# Altium project JacdacBrainESP32 48.PrjPCB (part 1 of 2)
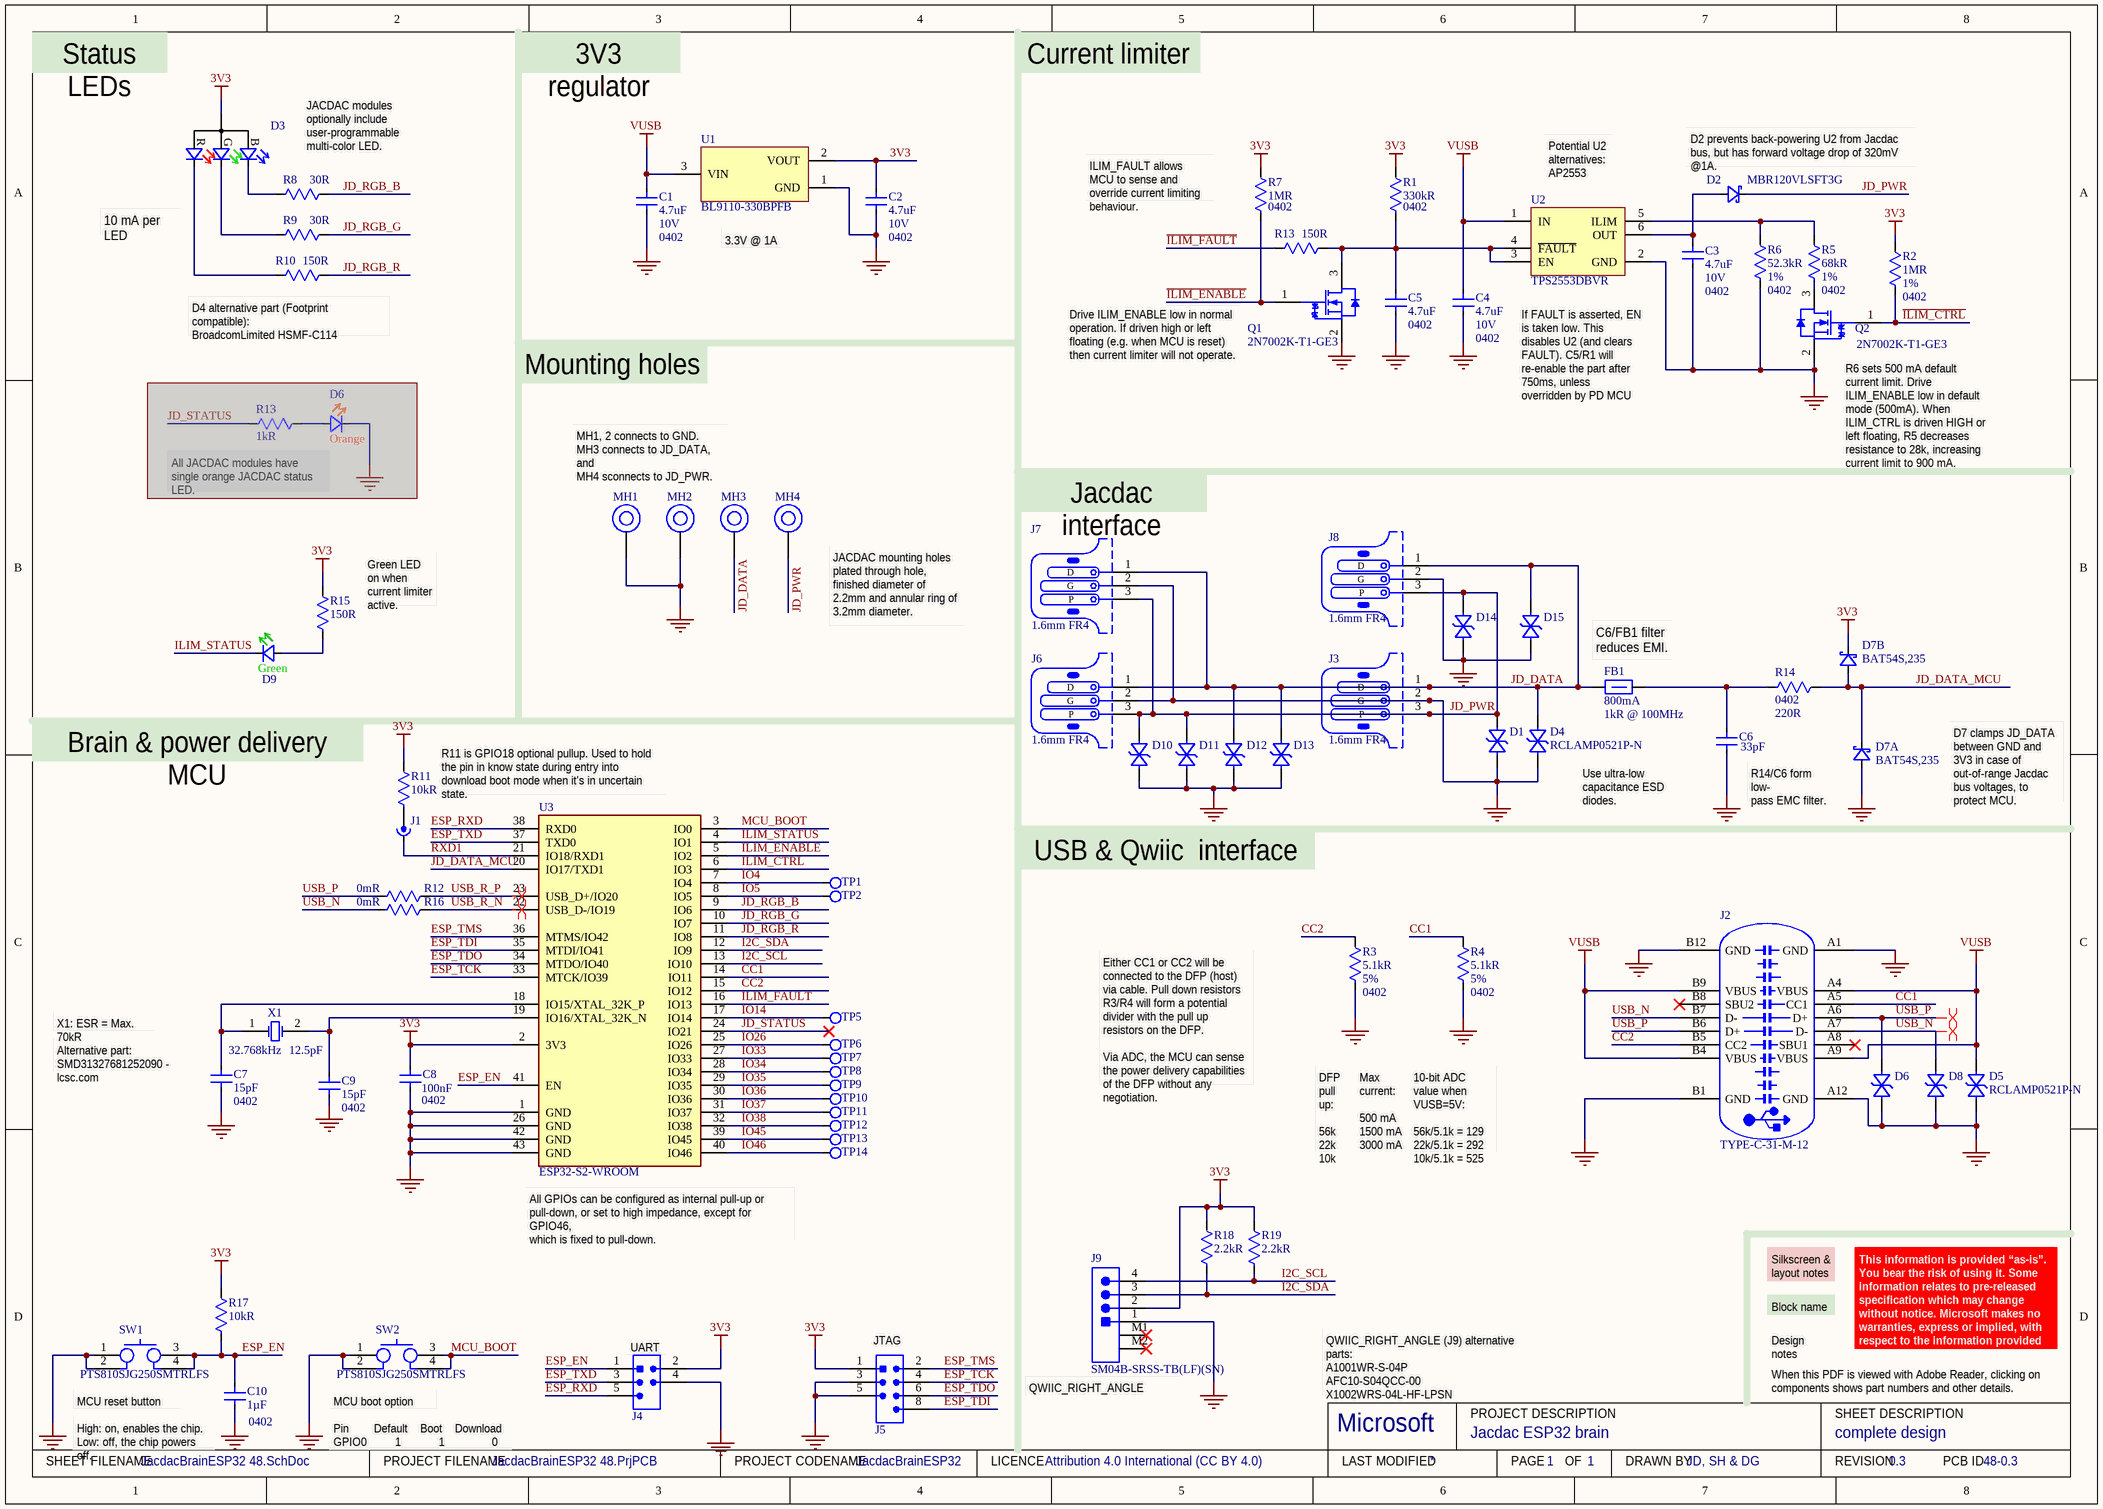
[diagram p0: JacdacBrainESP32 48.SchDoc]
ProjectCodeName: JacdacBrainESP32; ProjectCodenameDescription: Jacdac ESP32 brain; ProjectCodenameID: 48; ProjectDrawnBy: JD, SH & DG; ProjectLicenceTerms: Attribution 4.0 International (CC BY 4.0); ProjectRevision: 0.3
1 sheet, 80 parts. Net scope: global (net labels, ports and power ports of the same name join across sheets).
Board files: JacdacBrainESP32 48.PcbDoc, Panelized JacdacBrainESP32 48.PcbDoc

## Sheet JacdacBrainESP32 48.SchDoc: complete design
size A3; DrawnBy: JD, SH & DG; DocumentNumber: 1; Revision: 0.3; SheetNumber: 1; SheetTotal: 1; VersionControl_RevNumber: 1

### Parts
(Parts that share a designator on the sheet are numbered #1, #2 ... from top to bottom, then left to right.)
C1  Capacitance: 4.7uF  Voltage Rating: 10V  Case Code (Imperial): 0402  [R0402 - Without outline]  (hidden comment: CL05A475MP5NRNC)
C2  Capacitance: 4.7uF  Voltage Rating: 10V  Case Code (Imperial): 0402  [R0402 - Without outline]  (hidden comment: CL05A475MP5NRNC)
C3  Capacitance: 4.7uF  Voltage Rating: 10V  Case Code (Imperial): 0402  [R0402 - Without outline]  (hidden comment: CL05A475MP5NRNC)
C4  Capacitance: 4.7uF  Voltage Rating: 10V  Case Code (Imperial): 0402  [R0402 - Without outline]  (hidden comment: CL05A475MP5NRNC)
C5  Capacitance: 4.7uF  Case Code (Imperial): 0402  [R0402 - Without outline]  (hidden comment: CL05A475MP5NRNC)
C6  Capacitance: 33pF  [C0402_0.55MM - without outline]  (hidden comment: CL05C330JB5NNNC)
C7  Capacitance: 15pF  Case/Package: 0402  [C0402_0.55MM - without outline]  (hidden comment: CL05C150JB5NNNC)
C8  Capacitance: 100nF  Case Code (Imperial): 0402  [C0402_0.55MM - without outline]  (hidden comment: CL05B104KP5NNNC)
C9  Capacitance: 15pF  Case/Package: 0402  [C0402_0.55MM - without outline]  (hidden comment: CL05C150JB5NNNC)
C10  Capacitance: 1µF  Case Code (Imperial): 0402  [C0402_0.55MM - without outline]  (hidden comment: CL05A105KP5NNNC)
D1  RCLAMP0521P-N  [TVS 0402 - L]  (value not drawn)
D2  MBR120VLSFT3G  [MBR120VLSFT3G]
D3  TZ-P4-1615RGBTCA1-0.55T  [TZ-P4-1615RGBTCA1-0.55T]  (value not drawn)
D4  RCLAMP0521P-N  [TVS 0402 - L]
D5  RCLAMP0521P-N  [TVS 0402 - L]
D6#1  Colour: Orange  [Rohm SML-D12 Orange - without outline]  (hidden comment: SML-D12D)  (masked out: inside a compile mask, not in the netlist)
D6#2  RCLAMP0521P-N  [TVS 0402 - L]  (value not drawn)
D7  Manufacturer Part Number: BAT54S,235  [NXP-BAT54S-TO-236AB - without outline]  (hidden comment: BAT54S)  (parts A,B of 2)
D8  RCLAMP0521P-N  [TVS 0402 - L]  (value not drawn)
D9  Colour: Green  [0603 Green]  (hidden comment: 19-217/GHC-YR1S2/3T)
D10  RCLAMP0521P-N  [TVS 0402 - L]  (value not drawn)
D11  RCLAMP0521P-N  [TVS 0402 - L]  (value not drawn)
D12  RCLAMP0521P-N  [TVS 0402 - L]  (value not drawn)
D13  RCLAMP0521P-N  [TVS 0402 - L]  (value not drawn)
D14  RCLAMP0521P-N  [TVS 0402 - L]  (value not drawn)
D15  RCLAMP0521P-N  [TVS 0402 - L]  (value not drawn)
FB1  Current Rating: 800mA  Impedance: 1kR @ 100MHz  [TDK MPZ1608 0.8mm - without outline]  (hidden comment: TDK MPZ1608S102ATA00)
J1  OpenSolderBlob  [SolderBlobA]  (value not drawn)  (no BOM)
J2  TYPE-C-31-M-12  [TYPE-C-31-M-12]
J3  PCB Type: 1.6mm FR4  [JACDAC_EDGE_CONNECTOR_NO_TRACES]  (hidden comment: 3 pin jacdac edge connector)
J4  Uart Hack Connect Mini 1.27 mm pitch 2-row  [UART_HACK_CONNECT_MINI_5_X_1_27]  (value not drawn)
J5  7pin Jtag Hack Connect Mini 1.27 mm pitch 2-row  [JTAG_HACK_CONNECT_MINI_5_X_1_27]  (value not drawn)
J6  PCB Type: 1.6mm FR4  [JACDAC_EDGE_CONNECTOR_NO_TRACES]  (hidden comment: 3 pin jacdac edge connector)
J7  PCB Type: 1.6mm FR4  [JACDAC_EDGE_CONNECTOR_NO_TRACES]  (hidden comment: 3 pin jacdac edge connector)
J8  PCB Type: 1.6mm FR4  [JACDAC_EDGE_CONNECTOR_NO_TRACES]  (hidden comment: 3 pin jacdac edge connector)
J9  SM04B-SRSS-TB(LF)(SN)  [SM04B-SRSS-TB(LF)(SN)]
MH1  MH_5.0MMK_3.0MMC_2.1MMD_PTH  [MH_5.0MMK_3.0MMC_2.1MMD_PTH]  (value not drawn)  (no BOM)
MH2  MH_5.0MMK_3.0MMC_2.1MMD_PTH  [MH_5.0MMK_3.0MMC_2.1MMD_PTH]  (value not drawn)  (no BOM)
MH3  MH_5.0MMK_3.0MMC_2.1MMD_PTH  [MH_5.0MMK_3.0MMC_2.1MMD_PTH]  (value not drawn)  (no BOM)
MH4  MH_5.0MMK_3.0MMC_2.1MMD_PTH  [MH_5.0MMK_3.0MMC_2.1MMD_PTH]  (value not drawn)  (no BOM)
Q1  2N7002K-T1-GE3  [SOT-23-3 (TO-236)]
Q2  2N7002K-T1-GE3  [SOT-23-3 (TO-236)]
R1  Resistance: 330kR  Size Code: 0402  [R0402 - Without outline]  (hidden comment: RC0402FR-07330KL)
R2  Resistance: 1MR  Tolerance: 1%  Case Code (Imperial): 0402  [R0402 - Without outline]
R3  Resistance: 5.1kR  Tolerance: 5%  Case Code (Imperial): 0402  [R0402 - Without outline]  (hidden comment: RC0402JR-075K1L)
R4  Resistance: 5.1kR  Tolerance: 5%  Case Code (Imperial): 0402  [R0402 - Without outline]  (hidden comment: RC0402JR-075K1L)
R5  Resistance: 68kR  Tolerance: 1%  Case Code (Imperial): 0402  [R0402 - Without outline]  (hidden comment: RT0402FRE0768KL)
R6  Resistance: 52.3kR  Tolerance: 1%  Case Code (Imperial): 0402  [R0402 - Without outline]  (hidden comment: RC0402FR-0752K3L)
R7  Resistance: 1MR  Case Code (Imperial): 0402  [R0402 - Without outline]
R8  Resistance: 30R  [R0402 - Without outline]  (hidden comment: 0402WGF300JTCE)
R9  Resistance: 30R  [R0402 - Without outline]  (hidden comment: 0402WGF300JTCE)
R10  Resistance: 150R  [R0402 - Without outline]  (hidden comment: RC0402FR-07150RL)
R11  Resistance: 10kR  [R0402 - Without outline]  (hidden comment: 10k)
R12  Resistance: 0mR  [R0402 - Without outline]  (hidden comment: RC0402JR-070RL)
R13#1  Resistance: 150R  [R0402 - Without outline]  (hidden comment: RC0402FR-07150RL)
R13#2  Resistance: 1kR  [R0402 - Without outline]  (hidden comment: RC0402FR-071KL)  (masked out: inside a compile mask, not in the netlist)
R14  Case Code (Imperial): 0402  Resistance: 220R  [R0402 - Without outline]  (hidden comment: RC0402FR-07220RL)
R15  Resistance: 150R  [R0402 - Without outline]  (hidden comment: RC0402FR-07150RL)
R16  Resistance: 0mR  [R0402 - Without outline]  (hidden comment: RC0402JR-070RL)
R17  Resistance: 10kR  [R0402 - Without outline]  (hidden comment: 10k)
R18  Resistance: 2.2kR  [R0402 - Without outline]  (hidden comment: RC0402FR-072K2L)
R19  Resistance: 2.2kR  [R0402 - Without outline]  (hidden comment: RC0402FR-072K2L)
SW1  PTS810SJG250SMTRLFS  [PTS810]
SW2  PTS810SJG250SMTRLFS  [PTS810]
TP1  TestPoint  [Pad1.27mm]  (value not drawn)  (no BOM)
TP2  TestPoint  [Pad1.27mm]  (value not drawn)  (no BOM)
TP5  TestPoint  [Pad1.27mm]  (value not drawn)  (no BOM)
TP6  TestPoint  [Pad1.27mm]  (value not drawn)  (no BOM)
TP7  TestPoint  [Pad1.27mm]  (value not drawn)  (no BOM)
TP8  TestPoint  [Pad1.27mm]  (value not drawn)  (no BOM)
TP9  TestPoint  [Pad1.27mm]  (value not drawn)  (no BOM)
TP10  TestPoint  [Pad1.27mm]  (value not drawn)  (no BOM)
TP11  TestPoint  [Pad1.27mm]  (value not drawn)  (no BOM)
TP12  TestPoint  [Pad1.27mm]  (value not drawn)  (no BOM)
TP13  TestPoint  [Pad1.27mm]  (value not drawn)  (no BOM)
TP14  TestPoint  [Pad1.27mm]  (value not drawn)  (no BOM)
U1  BL9110-330BPFB  [SOT-223-]
U2  TPS2553DBVR  [TI-TPS2553]
U3  ESP32-S2-WROOM  [ESP32-S2-WROOM]
X1  Load Capacitance: 12.5pF  Frequency: 32.768kHz  [CRYSTAL-SMD-3.2X1.5]  (hidden comment: ECS-.327-12.5-34S-TR)

### Nets
3V3: C2.2 C8.2 D3.1(A) D7.2(K) J4.2(VCC) J5.1(VCC) J9.2(VCC) R1.1 R2.1 R7.1 R11.1 R15.2 R17.1 R18.1 R19.1 U1.2(VOUT) U3.2(3V3)
GND: C1.1 C2.1 C3.1 C4.1 C5.1 C6.1 C7.1 C8.1 C9.1 C10.1 D1.2(A) D4.2(A) D5.2(A) D6#2.2(A) D7.1(A) D8.2(A) D10.2(A) D11.2(A) D12.2(A) D13.2(A) D14.2(A) D15.2(A) J2.A1(GND) J2.A12(GND) J2.B1(GND) J2.B12(GND) J3.2(G) J4.4(GND) J5.3(GND) J5.5(RESET) J6.2(G) J7.2(G) J8.2(G) J9.1(GND) MH1.1 MH2.1 Q1.2(S) Q2.2(S) R3.2 R4.2 R6.1 SW1.1 SW1.2 SW2.1 SW2.2 U1.1(GND) U2.2(GND) U3.1(GND) U3.26(GND) U3.42(GND) U3.43(GND)
VUSB: C1.2 C4.2 D5.1(K) J2.A4(VBUS) J2.A9(VBUS) J2.B4(VBUS) J2.B9(VBUS) U1.3(VIN) U2.1(IN)
~{ILIM_CTRL}: Q2.1(G) R2.2 U3.6(IO3)
~{ILIM_ENABLE}: Q1.1(G) R7.2 U3.5(IO2)
~{ILIM_FAULT}: R13#1.1 U3.16(IO13)
CC1: J2.A5(CC1) R4.1 U3.14(IO11)
CC2: J2.B5(CC2) R3.1 U3.15(IO12)
ESP_EN: C10.2 J4.1(ESP_EN) R17.2 SW1.3 SW1.4 U3.41(EN)
ESP_RXD: J4.5(ESP_RXD) U3.38(RXD0)
ESP_TCK: J5.4(SWCLK/TCK) U3.33(MTCK/IO39)
ESP_TDI: J5.8(NC/TDI) U3.35(MTDI/IO41)
ESP_TDO: J5.6(SWO/TDO) U3.34(MTDO/IO40)
ESP_TMS: J5.2(SWDIO/TMS) U3.36(MTMS/IO42)
ESP_TXD: J4.3(ESP_TXD) U3.37(TXD0)
I2C_SCL: J9.4(SCL) R19.2 U3.13(IO10)
I2C_SDA: J9.3(SDA) R18.2 U3.12(IO9)
ILIM_STATUS: D9.1(K) U3.4(IO1)
IO4: TP1.1 U3.7(IO4)
IO5: TP2.1 U3.8(IO5)
IO14: TP5.1 U3.17(IO14)
IO26: TP6.1 U3.25(IO26)
IO33: TP7.1 U3.27(IO33)
IO34: TP8.1 U3.28(IO34)
IO35: TP9.1 U3.29(IO35)
IO36: TP10.1 U3.30(IO36)
IO37: TP11.1 U3.31(IO37)
IO38: TP12.1 U3.32(IO38)
IO45: TP13.1 U3.39(IO45)
IO46: TP14.1 U3.40(IO46)
JD_DATA: D4.1(K) D12.1(K) D13.1(K) D15.1(K) FB1.1 J3.1(D) J6.1(D) J7.1(D) J8.1(D) MH3.1
JD_DATA_MCU: D7.3(K) R14.1 U3.20(IO17/TXD1)
JD_PWR: D1.1(K) D2.1(K) D10.1(K) D11.1(K) D14.1(K) J3.3(P) J6.3(P) J7.3(P) J8.3(P) MH4.1
JD_RGB_B: R8.2 U3.9(IO6)
JD_RGB_G: R9.2 U3.10(IO7)
JD_RGB_R: R10.2 U3.11(IO8)
JD_STATUS: U3.24(IO21)
MCU_BOOT: SW2.3 SW2.4 U3.3(IO0)
RXD1: J1.2 U3.21(IO18/RXD1)
USB_N: D8.1(K) J2.A7(D-) J2.B7(D-) R16.1
USB_P: D6#2.1(K) J2.A6(D+) J2.B6(D+) R12.1
USB_R_N: R16.2 U3.22(USB_D-/IO19)
USB_R_P: R12.2 U3.23(USB_D+/IO20)
NetC3_2: C3.2 D2.2(A) U2.6(OUT)
NetC5_2: C5.2 Q1.3(D) R1.2 R13#1.2 U2.3(EN) U2.4(~{FAULT})
NetC6_2: C6.2 FB1.2 R14.2
NetC7_2: C7.2 U3.18(IO15/XTAL_32K_P) X1.1(OSC1/OSC2)
NetC9_2: C9.2 U3.19(IO16/XTAL_32K_N) X1.2(OSC2/OSC1)
NetD3_2: D3.2(R) R10.1
NetD3_3: D3.3(G) R9.1
NetD3_4: D3.4(B) R8.1
NetD9_2: D9.2(A) R15.1
NetJ1_1: J1.1 R11.2
NetQ2_3: Q2.3(D) R5.1
NetR5_2: R5.2 R6.2 U2.5(ILIM)

Not connected (* = marked no-connect by the designer): J2 A8(SBU1)* B8(SBU2)*; J9 M1* M2*

### Layout directives
differential pair: USB_N, USB_P, USB_R_N, USB_R_P

### Notes on the sheet
- Status LEDs
- 3V3 regulator
- Current limiter
- JACDAC modules optionally include user-programmable multi-color LED.
- (near U2) Potential U2 alternatives:
  AP2553
- (near D2) D2 prevents back-powering U2 from Jacdac bus, but has forward voltage drop of 320mV @1A.
- (near D3) 10 mA per LED
- (near U1) 3.3V @ 1A
- (near R7) ILIM_FAULT allows MCU to sense and override current limiting behaviour.
- (near R10) D4 alternative part (Footprint compatible):
  BroadcomLimited HSMF-C114
- Mounting holes
- Drive ILIM_ENABLE low in normal operation. If driven high or left floating (e.g. when MCU is reset) then current limiter will not operate.
- If FAULT is asserted, EN is taken low. This disables U2 (and clears FAULT). C5/R1 will re-enable the part after 750ms, unless overridden by PD MCU
- (near Q2) R6 sets 500 mA default current limit. Drive ILIM_ENABLE low in default mode (500mA). When ILIM_CTRL is driven HIGH or left floating, R5 decreases resistance to 28k, increasing current limit to 900 mA.
- All JACDAC modules have single orange JACDAC status LED.
- MH1, 2 connects to GND.
  MH3 connects to JD_DATA, and
  MH4 sconnects to JD_PWR.
- Jacdac interface
- (near R15) Green LED on when current limiter active.
- (near MH4) JACDAC mounting holes  plated through hole, finished diameter of 2.2mm and annular ring of 3.2mm diameter.
- (near FB1) C6/FB1 filter reduces EMI.
- (near R11) Brain & power delivery MCU
- R11 is GPIO18 optional pullup. Used to hold the pin in know state during entry into download boot mode when it's in uncertain state.
- Use ultra-low capacitance ESD diodes.
- R14/C6 form low-
  pass EMC filter.
- D7 clamps JD_DATA between GND and 3V3 in case of out-of-range Jacdac bus voltages, to protect MCU.
- USB & Qwiic  interface
- X1: ESR = Max. 70kR
- (near C7) Alternative part:
  SMD31327681252090 - lcsc.com
- Either CC1 or CC2 will be connected to the DFP (host) via cable. Pull down resistors R3/R4 will form a potential divider with the pull up resistors on the DFP.
  Via ADC, the MCU can sense the power delivery capabilities of the DFP without any negotiation.
- DFP pull up:
  56k
  22k
  10k
- Max current:
  500 mA
  1500 mA
  3000 mA
- 10-bit ADC value when VUSB=5V:
  56k/5.1k = 129
  22k/5.1k = 292
  10k/5.1k = 525
- All GPIOs can be configured as internal pull-up or pull-down, or set to high impedance, except for GPIO46,
  which is fixed to pull-down.
- Block name
- Silkscreen & layout notes
- (near J4) UART
- (near J5) JTAG
- (near J9) QWIIC_RIGHT_ANGLE
- QWIIC_RIGHT_ANGLE (J9) alternative parts:
  A1001WR-S-04P
  AFC10-S04QCC-00
  X1002WRS-04L-HF-LPSN
- Design notes
- When this PDF is viewed with Adobe Reader, clicking on components shows part numbers and other details.
- This information is provided “as-is”. You bear the risk of using it. Some information relates to pre-released specification which may change without notice. Microsoft makes no warranties, express or implied, with respect to the information provided here.
- (near SW1) MCU reset button
- (near C10) High: on, enables the chip.
  Low: off, the chip powers off.
- (near SW2) MCU boot option
- (near SW2) Pin        Default    Boot    Download
  GPIO0         1            1               0
- Microsoft
- PROJECT DESCRIPTION
- SHEET DESCRIPTION
- SHEET FILENAME
- PROJECT FILENAME
- PROJECT CODENAME
- LICENCE
- LAST MODIFIED
- PAGE
- OF
- DRAWN BY
- REVISION
- PCB ID

### Library data of the parts
C1-C5 = CL05A475MP5NRNC: CAP CER 4.7UF 10V X5R 0402; Manufacturer: Samsung; Tolerance: 20%; Supplier 1: Digi-Key; Manufacturer Part Number: CL05A475MP5NRNC; RoHS: Yes; Category: Ceramic Capacitors; Stock 1: 840000; Pricing 1: 10000=0.01405, 20000=0.01338 (USD); Mount: Surface Mount; Case/Package: 0402; Case Code (Metric): 1005; Min Operating Temperature: -55°C; Max Operating Temperature: 85°C; Package Quantity: 10000; Packaging: Tape and Reel; Dielectric: X5R; Series: CL; Length: 0.039inch; Width: 0.02inch; Thickness: 0.022inch; Lead Free: Lead Free; RoHS Compliant: Yes; ComponentLink1URL: https://datasheet.ciiva.com/25786/cl05a475mp5nrnc-25786963.pdf; ComponentLink1Description: Online datasheet; Supplier 2: Future Electronics; Stock 2: 2004; Pricing 2: 1=0.23500, 500=0.03970, 1500=0.02900, 2500=0.02500, 5000=0.02050 (USD); Created By: D. Gakure; Checked By: ?; Supplier Part Number 2: 2103694; Supplier Part Number 1: 1276-1482-2-ND
  C5: Voltage Rating: 10V
C6 = CL05C330JB5NNNC: Cap Ceramic 33pF 50V C0G 5% SMD 0402 125C Paper T/R; Manufacturer: Samsung; Temperature Coefficient: 300ppm/°C; Supplier 1: Digi-Key; Manufacturer Part Number: CL05C330JB5NNNC; RoHS: Yes; Category: Ceramic Capacitors; Stock 1: 5436288; Pricing 1: 1=0.10000, 10=0.02300, 50=0.01260, 100=0.01040, 500=0.00740, 1000=0.00582, 2500=0.00529, 5000=0.00487 (USD); Mount: Surface Mount; Case Code (Metric): 1005; Case Code (Imperial): 0402; Material: Ceramic; Contact Plating: Tin; Min Operating Temperature: -55°C; Max Operating Temperature: 125°C; Package Quantity: 1; Packaging: Tape and Reel; Dielectric: C0G; Voltage: 50V; Voltage Rating (DC): 50V; Series: CL; Construction: Flat; Length: 1mm; Width: 0.02inch; Height: 0.5mm; Thickness: 0.022inch; Depth: 0.5mm; Radiation Hardening: No; Lead Free: Lead Free; RoHS Compliant: Yes; Supplier 2: Farnell; Supplier 3: Mouser; Supplier Part Number 3: 187-CL05C330JB5NNNC; Supplier Part Number 2: 3013373; Supplier Part Number 1: 1276-1272-1-ND; Tolerance: 5%; Case/Package: 0402; Voltage Rating: 50V
C7 C9 = CL05C150JB5NNNC: CAP CER 15PF 50V C0G/NP0 0402; Manufacturer: Samsung; Material: Ceramic; Tolerance: 5%; Dielectric: C0G; Temperature Coefficient: 300ppm/°C; Supplier 1: Digi-Key; Manufacturer Part Number: CL05C150JB5NNNC; RoHS: Yes; Category: Ceramic Capacitors; Stock 1: 822355; Pricing 1: 1=0.10000, 10=0.02600, 50=0.01440, 100=0.01180, 500=0.00842, 1000=0.00661, 2500=0.00601, 5000=0.00553 (USD); Mount: Surface Mount; Case Code (Metric): 1005; Contact Plating: Tin; Min Operating Temperature: -55°C; Max Operating Temperature: 125°C; Package Quantity: 1; Packaging: Tape and Reel; Voltage Rating: 50V; Voltage: 50V; Series: CL; Construction: Flat; Length: 1mm; Width: 0.02inch; Height: 0.5mm; Thickness: 0.022inch; Depth: 0.5mm; Radiation Hardening: No; RoHS Compliant: Yes; ComponentLink1URL: https://datasheet.ciiva.com/15195/getdatasheetpartid-497170-15195669.pdf; ComponentLink1Description: Online datasheet; Supplier 2: Mouser; Stock 2: 313617; Pricing 2: 1=0.10000, 10=0.01400, 50=0.01400, 100=0.01200, 1000=0.00700, 10000=0.00500 (USD); Supplier Part Number 2: 187-CL05C150JB5NNNC; Supplier Part Number 1: 1276-1179-1-ND; Case Code (Imperial): 0402
C8 = CL05B104KP5NNNC: CAP CER 0.1UF 10V X7R 0402; Manufacturer: Samsung; Tolerance: 10%; Supplier 1: Digi-Key; Manufacturer Part Number: CL05B104KP5NNNC; RoHS: Yes; Category: Ceramic Capacitors; Stock 1: 17321183; Pricing 1: 1=0.10000, 10=0.02500, 50=0.01380, 100=0.01130, 500=0.00804, 1000=0.00632, 2500=0.00575, 5000=0.00529 (USD); Mount: Surface Mount; Case/Package: 0402; Case Code (Metric): 1005; Contact Plating: Tin; Min Operating Temperature: -55°C; Max Operating Temperature: 125°C; Package Quantity: 1; Packaging: Tape and Reel; Dielectric: X7R; Length: 1mm; Width: 0.02inch; Height: 0.5mm; Thickness: 0.022inch; Depth: 0.5mm; Radiation Hardening: No; ComponentLink1URL: https://datasheet.ciiva.com/15165/getdatasheetpartid-37100-15165107.pdf; ComponentLink1Description: Samsung datasheet online; Supplier 2: Mouser; Stock 2: 984124; Pricing 2: 10000=0.00400, 20000=0.00400, 50000=0.00400 (USD); Supplier 3: Farnell; Stock 3: 39022; Pricing 3: 10=0.01620, 100=0.01310, 500=0.00740, 2500=0.00600, 5000=0.00470, 10000=0.00400, 50000=0.00320 (GBP); Supplier 4: Newark; Stock 4: 56730; Pricing 4: 1=0.09000, 25=0.02300, 100=0.01000, 250=0.00900, 500=0.00700, 1000=0.00500, 2500=0.00500 (USD); Supplier 5: Future Electronics; Stock 5: 20877033; Pricing 5: 1=0.00460, 500=0.00340, 1500=0.00320, 2500=0.00310, 5000=0.00300 (USD); Supplier Part Number 5: 9032525; Supplier Part Number 4: 82AC9219; Supplier Part Number 2: 187-CL05B104KP5NNNC; Supplier Part Number 1: 1276-1002-1-ND; Created: DG; Checked: ?; Supplier Part Number 3: 3013351; Voltage Rating: 10V
C10 = CL05A105KP5NNNC: CAP CER 1UF 10V X5R 0402; Manufacturer: Samsung; Material: Ceramic; Tolerance: 10%; Supplier 1: Digi-Key; Manufacturer Part Number: CL05A105KP5NNNC; RoHS: Yes; Category: Capacitors; Stock 1: 5705569; Pricing 1: 1=0.10000, 10=0.03900, 50=0.02100, 100=0.01720, 500=0.01228, 1000=0.00965, 2500=0.00877, 5000=0.00807 (USD); Mount: Surface Mount; Case/Package: 0402; Case Code (Metric): 1005; Contact Plating: Tin; Min Operating Temperature: -55°C; Max Operating Temperature: 85°C; Dielectric: X5R; Package Quantity: 1; Packaging: Tape and Reel; Length: 1mm; Height: 0.5mm; Width: 0.02inch; Thickness: 0.022inch; Depth: 0.5mm; Radiation Hardening: No; ComponentLink1URL: https://datasheet.ciiva.com/15195/getdatasheetpartid-358390-15195630.pdf; ComponentLink1Description: Online datasheet; Supplier 2: Mouser; Stock 2: 928941; Pricing 2: 1=0.10000, 10=0.04200, 100=0.01800, 500=0.01300, 1000=0.01000, 2500=0.00900 (USD); Supplier 3: Farnell; Stock 3: 53670; Pricing 3: 10=0.02450, 100=0.02000, 500=0.01310, 2500=0.00920, 5000=0.00810, 10000=0.00640, 50000=0.00490 (GBP); Supplier Part Number 3: 3013329; Supplier Part Number 2: 187-CL05A105KP5NNNC; Supplier Part Number 1: 1276-1076-1-ND; Created: DG; Checked: ?; Voltage Rating: 10V
D1 D4 D5 D6#2 D8 D10-D15 = RCLAMP0521P-N: Bidirectional 5V (Max) 6V 16V 3.5A (8/20us) 0402 TVS RoHS; Manufacturer: Born Semiconductor; Package: 0402; Created By: D Gakure; Checked By: ?; Supplier1: LCSC; Supplier1 Part Number: C316043; ComponentLink1Description: Online datasheet; ComponentLink1URL: https://datasheet.lcsc.com/szlcsc/Bourne-Semicon-Shenzhen-RCLAMP0521P-N_C316043.pdf; Manufacturer Part Number: RCLAMP0521P-N
D2 = MBR120VLSFT3G: DIODE SCHOTTKY 20V 1A SOD123FL; Manufacturer: ON Semiconductor; Max Surge Current: 45A; Forward Voltage: 340mV; Peak Reverse Current: 600uA; Element Configuration: Single; Polarity: Standard; Supplier 1: Digi-Key; RoHS: Yes; Category: Schottky Diodes; Stock 1: 32481; Pricing 1: 1=0.39000, 10=0.28600, 100=0.19920, 500=0.12616, 1000=0.10292, 2000=0.09960, 5000=0.09628 (USD); Number of Pins: 2; Min Operating Temperature: -65°C; Max Operating Temperature: 125°C; Package Quantity: 10000; Forward Current: 1A; Packaging: Tape and Reel; Max Reverse Leakage Current: 600uA; Average Rectified Current: 1A; Peak Non-Repetitive Surge Current: 45A; Max Repetitive Reverse Voltage (Vrrm): 20V; Max Forward Surge Current (Ifsm): 45A; Voltage Rating (DC): 20V; Current Rating: 1A; Output Current: 1A; Max Reverse Voltage (DC): 20V; Radiation Hardening: No; REACH SVHC: No SVHC; Lead Free: Lead Free; Halogen Free: Halogen Free; ComponentLink4URL: https://datasheet.ciiva.com/6380/mbr120vlsft1-d-6380910.pdf; ComponentLink4Description: On Semi datasheet online; Supplier 2: Mouser; Supplier 3: RSComponents; Supplier Part Number 3: 1867479; Supplier Part Number 2: 863-MBR120VLSFT3G; Supplier Part Number 1: MBR120VLSFT3GOSCT-ND; Manufacturer Part Number: MBR120VLSFT3G
D3 = TZ-P4-1615RGBTCA1-0.55T: 1615 Light Emitting Diodes (LED) RoHS; Manufacturer: TUOZHAN; Manufacturer Part Number: TZ-P4-1615RGBTCA1-0.55T; Category: Optoelectronics; Package: 1615; ComponentLink1Description: Online datasheet; ComponentLink1URL: https://datasheet.lcsc.com/szlcsc/2009041238_TUOZHAN-TZ-P4-1615RGBTCA1-0-55T_C779813.pdf; RoHS: RoHS Compliant; Supplier 1: LCSC; Size / Dimension: 1.6x1.5mm; Supplier 1 Part Number: C779813; Packaging: Tape & Reel (TR); Created By: D. Gakure; Checked By: ?
D6#1 = SML-D12D: 1.6 x 0.8 x 0.55mm (0603) LED 605nm Orange; Manufacturer: Rohm Semiconductor; Manufacturer Part Number: SML-D12D8WT86; Millicandela Rating: 100mcd; Voltage - Forward (Vf) (Typ): 2.2V; Current - Test: 20mA; Lens Type: Diffused, White; Lens Style/Size: Rectangle with Flat Top, 1.2mm x 0.8mm; Supplier 1: Digi-Key; RoHS: RoHS Compliant; Category: Optoelectronics; Stock 1: 1719; Pricing 1: 1=0.38, 10=0.279, 25=0.2232, 100=0.1478, 250=0.1046, 500=0.08926, 1000=0.06974 (GBP); Packaging: Cut Tape (CT); Wavelength - Dominant: 605nm; Wavelength - Peak: -; Viewing Angle: -; Package / Case: 0603 (1608 Metric); Size / Dimension: 1.60mm L x 0.80mm W; Height: 0.55mm; Mounting Type: Surface Mount; Luminous Flux @ Current - Test: -; ComponentLink1URL: https://d1d2qsbl8m0m72.cloudfront.net/en/products/databook/datasheet/opto/led/chip_mono/sml-d12x8_d13x8-e.pdf; ComponentLink1Description: Online datasheet; Supplier Part Number 1: 511-1577-1-ND
D7 = BAT54S: DIODE ARRAY SCHOTTKY 30V SOT23; Manufacturer: Nexperia; Supplier 1: Digi-Key; RoHS: No; Category: Rectifier Diodes; Stock 1: 14011; Pricing 1: 1=0.13000, 10=0.11900, 100=0.05610, 500=0.03326, 1000=0.02185, 5000=0.02138 (USD); ComponentLink1URL: https://assets.nexperia.com/documents/data-sheet/BAT54_SER.pdf; ComponentLink1Description: NXP datasheet online; Supplier 2: Mouser; Supplier 3: RSComponents; Supplier Part Number 2: 771-BAT54S235; Supplier Part Number 3: 1707990; Supplier Part Number 1: 1727-1868-1-ND
D9 = 19-217/GHC-YR1S2/3T: LED GREEN DIFFUSED 0603 SMD; Manufacturer: Everlight Elec; Manufacturer Part Number: 19-217/GHC-YR1S2/3T; Mount: Surface Mount; Case/Package: 0603; Color: Green; Case Code (Imperial): 0603; ComponentLink1URL: https://datasheet.lcsc.com/lcsc/1811101510_Everlight-Elec-19-217-GHC-YR1S2-3T_C72043.pdf; ComponentLink1Description: Online datasheet; Supplier 1: LCSC; Supplier 1 Part Number: C72043
FB1 = TDK MPZ1608S102ATA00: 0603 1k@100MHz 0.8A chip; Core Material: Ferrite; Tolerance: 25%; DC Resistance (DCR): 300mR; Supplier 1: Digi-Key; Stock 1: 113542; Pricing 1: 1=0.1, 10=0.079, 25=0.0716, 50=0.0644, 100=0.0472, 250=0.03432, 500=0.03146, 1000=0.02717 (USD); Mount: Surface Mount; Case/Package: 0603; Case Code (Metric): 1608; Case Code (Imperial): 0603; Package Quantity: 4000; Packaging: Tape and Reel; Max DC Current: 800mA; Length: 0.063inch; Height: 0.037inch; Width: 0.031inch; ComponentLink2URL: https://www.mouser.co.uk/datasheet/2/400/eads_commercial_power_mpz1608_en-923650.pdf; ComponentLink2Description: datasheet online; Supplier 2: Mouser; ComponentLink3Description: datasheet; ComponentLink3URL: Y:\System\Altium\Libraries 2014\TDK\Datasheets\eads_commercial_power_mpz1608_en-923650.pdf; Supplier Part Number 1: 445-8694-1-ND; Supplier Part Number 2: 810-MPZ1608S102ATA00; Manufacturer: TDK; Manufacturer Part Number: MPZ1608S102ATA00
J1 = OpenSolderBlob: Open solder blob
J2 = TYPE-C-31-M-12: USB - Type C Female 16 USB Connectors RoHS; Manufacturer: Korean Hroparts Elec; Gender: Receptacle; Number of Positions: 16; RoHS: Yes; Category: USB Connectors; Orientation: Right Angle; ComponentLink1URL: https://datasheet.lcsc.com/szlcsc/1811131825_Korean-Hroparts-Elec-TYPE-C-31-M-12_C165948.pdf; ComponentLink1Description: Online datasheet; Supplier 1 Part Number: C165948; Supplier 1: LCSC; Manufacturer Part Number: TYPE-C-31-M-12
J3 J6-J8 = Jacdac edge connector: 3 pin Jacdac edge connector 1.27mm pitch; Manufacturer Part Number: JACDAC_EDGE_CONNECTOR; Checked By: ?; Created By: D. Gakure; ComponentLink1Description: Yuliang JACDAC cable connector drawing online; ComponentLink1URL: https://github.com/microsoft/jacdac-mdk/blob/main/connector/JACDAC-Connector-by-Yuliang-2020-11-28.pdf; ComponentLink2Description: JACDAC PCB edge connector spec onlin; ComponentLink2URL: https://github.com/microsoft/jacdac-mdk/blob/main/connector/JACDAC_PCB_Edge_Connector_Drawing_JD-PEC-01_rev_01.pdf
J4 = UART_HACK_CONNECT_MINI
J5 = JTAG_HACK_CONNECT
J9 = SM04B-SRSS-TB(LF)(SN): CONN HEADER SMD R/A 4POS 1MM; Manufacturer: JST; Number of Positions: 4; Connector Type: Male Pin; Contact Resistance: 40mR; Max Current Rating: 1A; Max Voltage Rating (AC): 50V; Pitch: 0.039inch; Supplier 1: Digi-Key; RoHS: Yes; Category: Connectors; Pricing 1: 1=0.55000, 10=0.51700, 100=0.39640, 500=0.34468, 1000=0.28436 (USD); Mount: Surface Mount; Contact Material: Copper Alloy; Contact Plating: Tin,Copper; Color: Natural; Housing Material: Polyamide; Housing Color: Beige; Min Operating Temperature: -25°C; Max Operating Temperature: 85°C; Number of Rows: 1; Termination: Solder; Packaging: Tape and Reel; Orientation: Right Angle; Number of Contacts: 4; Max Voltage Rating (DC): 50V; Length: 6mm; Depth: 4.95mm; Lead Free: Lead Free; ComponentLink1URL: https://datasheet.ciiva.com/26894/getdatasheetpartid-499363-26894945.pdf?src-supplier=Verical; ComponentLink1Description: Online datasheet; Supplier 2: Farnell; Stock 2: 8030; Pricing 2: 10=0.42800, 100=0.32800, 500=0.28500, 1000=0.23600, 2500=0.23100 (GBP); Supplier 3: Future Electronics; Stock 3: 9000; Pricing 3: 3000=0.36000, 6000=0.29000 (USD); Supplier 4: Newark; Stock 4: 10006; Pricing 4: 1=0.67900, 10=0.63700, 25=0.54900, 50=0.49500, 100=0.46200, 250=0.41000, 500=0.39800, 1000=0.36200 (USD); Supplier Part Number 4: 87R0314; Supplier Part Number 3: 4517173; Supplier Part Number 2: 1830839; Supplier Part Number 1: 455-1804-1-ND; Manufacturer Part Number: SM04B-SRSS-TB(LF)(SN)
MH1-MH4 = MH_5.0MMK_3.0MMC_2.1MMD_PTH: Mounting Hole 5.0mm keepout, 3.0mm annualar ring and 2.1mm Drill PTH
Q1 Q2 = 2N7002K-T1-GE3: Trans MOSFET N-CH Si 60V 0.3A 3-Pin SOT-23 T/R; Manufacturer: Vishay; Rds On Max: 2R; Input Capacitance: 30pF; Max Power Dissipation: 350mW; Continuous Drain Current (ID): 300mA; Element Configuration: Single; Nominal Vgs: 2V; Number of Elements: 1; Gate to Source Voltage (Vgs): 20V; Turn-Off Delay Time: 35ns; Threshold Voltage: 1V; Turn-On Delay Time: 25ns; Supplier 1: Digi-Key; RoHS: Yes; Category: MOSFETs; Pricing 1: 1=0.27000, 10=0.21800, 25=0.18200, 100=0.11540, 500=0.07590, 1000=0.05161 (USD); Mount: Surface Mount; Case/Package: SOT-23; Number of Pins: 3; Contact Plating: Tin,Matte; Weight: 0.050717oz; Min Operating Temperature: -55°C; Max Operating Temperature: 150°C; Packaging: Tape and Reel; Drain to Source Voltage (Vdss): 60V; On-State Resistance: 2R; Voltage: 60V; Package Quantity: 1; Number of Channels: 1; Drain to Source Breakdown Voltage: 60V; Drain to Source Resistance: 2R; Power Dissipation: 350mW; Length: 3.04mm; Width: 1.4mm; Height: 1.02mm; Radiation Hardening: No; Lead Free: Lead Free; REACH SVHC: Unknown; ComponentLink1URL: https://datasheet.ciiva.com/2957/2n7002k-2957216.pdf; ComponentLink1Description: Online datasheet; Supplier 2: RSComponents; Stock 2: 1; Pricing 2: 100=0.11100 (USD); Supplier Part Number 1: 2N7002K-T1-GE3CT-ND; Supplier Part Number 2: 7879058P; Manufacturer Part Number: 2N7002K-T1-GE3
R1 = RC0402FR-07330KL: RES SMD 330K OHM 1% 1/16W 0402; Manufacturer: Yageo; Power Rating: 63mW; Voltage Rating: 50V; Temperature Coefficient: 100ppm/°C; Supplier 1: Digi-Key; Manufacturer Part Number: RC0402FR-07330KL; RoHS: Yes; Category: Chip SMD Resistors; Stock 1: 78809; Pricing 1: 1=0.10000, 10=0.01600, 100=0.00660, 1000=0.00299, 2500=0.00259, 5000=0.00214 (USD); Case/Package: 0402; Case Code (Metric): 1005; Case Code (Imperial): 0402; Min Operating Temperature: -55°C; Max Operating Temperature: 155°C; Package Quantity: 1; Packaging: Tape and Reel; Resistor Type: Thick Film; Number of Terminations: 2; Termination: SMD/SMT; Max Power Dissipation: 63mW; Features: Moisture Resistant; Series: RC; Resistance Tolerance: 1%; Construction: Rectangular; Length: 1mm; Width: 0.02inch; Height: 0.016inch; Depth: 0.5mm; REACH SVHC: Unknown; Military Standard: Not; Lead Free: Lead Free; RoHS Compliant: Yes; ComponentLink1URL: https://datasheet.ciiva.com/2518/pyu-r-int-thick-7-2518994.pdf?src-supplier=Digi-Key; ComponentLink1Description: Online datasheet; Supplier 2: Mouser; Stock 2: 218637; Pricing 2: 1=0.10000, 10=0.01400, 50=0.01400, 100=0.00500, 1000=0.00300, 10000=0.00200 (USD); Supplier 3: Farnell; Stock 3: 310234; Pricing 3: 10=0.01210, 100=0.00460, 500=0.00410, 2500=0.00310, 5000=0.00280, 10000=0.00250, 50000=0.00180 (GBP); Supplier Part Number 2: 603-RC0402FR-07330KL; Supplier Part Number 1: 311-330KLRCT-ND; Supplier Part Number 3: 9239537; Created By: D Gakure; Tolerance: 1%; Checked By: ?
R2 R7 = RC0402FR-071ML: RES SMD 1M OHM 1% 1/16W 0402; Manufacturer: Yageo; Power Rating: 63mW; Voltage Rating: 50V; Temperature Coefficient: 100ppm/°C; Supplier 1: Digi-Key; Manufacturer Part Number: RC0402FR-071ML; RoHS: Yes; Category: Chip SMD Resistors; Stock 1: 7856490; Pricing 1: 1=0.10000, 10=0.01600, 100=0.00640, 1000=0.00286, 2500=0.00248, 5000=0.00205 (USD); Case/Package: 0402; Case Code (Metric): 1005; Size Code: 0402; Min Operating Temperature: -55°C; Max Operating Temperature: 155°C; Resistor Type: Thick Film; Packaging: Tape and Reel; Termination: SMD/SMT; Features: Moisture Resistant; Series: RC; Max Power Dissipation: 63mW; Number of Terminations: 2; Resistance Tolerance: 1%; Construction: Rectangular; Technology: THICK FILM; Length: 1mm; Height: 0.32mm; Depth: 0.5mm; RoHS Compliant: Yes; REACH SVHC: Unknown; Military Standard: Not; Lead Free: Lead Free; ComponentLink1URL: https://datasheet.ciiva.com/11808/0900766b80c66297-11808125.pdf; ComponentLink1Description: Online datasheet; Supplier 2: Mouser; Stock 2: 1194490; Pricing 2: 1=0.10000, 10=0.01200, 50=0.01200, 100=0.00400, 1000=0.00400, 10000=0.00300 (USD); Supplier 3: Farnell; Stock 3: 1530000; Pricing 3: 10000=0.00290, 50000=0.00200 (GBP); Created By: D. Gakure; Supplier Part Number 2: 603-RC0402FR-071ML; Supplier Part Number 1: 311-1.00MLRCT-ND; Checked By: ?; Supplier Part Number 3: 2421892
  R7: Tolerance: 1%
R3 R4 = RC0402JR-075K1L: RES SMD 5.1K OHM 5% 1/16W 0402; Manufacturer: Yageo; Voltage Rating: 50V; Power Rating: 62.5mW; Temperature Coefficient: 100ppm/°C; Max Power Dissipation: 63mW; Supplier 1: Digi-Key; Manufacturer Part Number: RC0402JR-075K1L; RoHS: Yes; Category: Chip SMD Resistors; Stock 1: 1270619; Pricing 1: 1=0.10000, 10=0.01300, 100=0.00520, 1000=0.00233, 2500=0.00202, 5000=0.00167 (USD); Case/Package: 0402; Case Code (Metric): 1005; Weight: 2.3E-05oz; Size Code: 0402; Min Operating Temperature: -55°C; Max Operating Temperature: 155°C; Packaging: Tape and Reel; Resistor Type: Thick Film; Termination: SMD/SMT; Voltage Rating (DC): 50V; Features: Moisture Resistant; Series: RC; Number of Terminations: 2; Construction: Rectangular; Resistance Tolerance: 5%; Length: 1mm; Width: 0.5mm; Height: 0.35mm; Depth: 0.5mm; REACH SVHC: No SVHC; Military Standard: Not; Lead Free: Lead Free; RoHS Compliant: Yes; ComponentLink2URL: https://datasheet.ciiva.com/16740/pyu-rc0402-51-rohs-l-6-r-16740925.pdf; ComponentLink2Description: Onnline datasheet; Supplier 2: Newark; Stock 2: 1265; Pricing 2: 1=0.10000, 25=0.01000, 100=0.00400, 250=0.00400, 500=0.00300, 1000=0.00300 (USD); Supplier 3: Mouser; Stock 3: 100817; Pricing 3: 1=0.10000, 10=0.01000, 50=0.01000, 100=0.00400, 1000=0.00300, 10000=0.00200 (USD); Supplier 4: Farnell; Stock 4: 68890; Pricing 4: 10=0.00910, 100=0.00390, 500=0.00320, 2500=0.00240, 5000=0.00210, 10000=0.00190, 50000=0.00150 (GBP); Supplier 5: Farnell; Stock 5: 1265; Pricing 5: 10000=0.00270 (GBP); Supplier Part Number 5: 1799293; Supplier Part Number 4: 3495714; Supplier Part Number 3: 603-RC0402JR-075K1L; Supplier Part Number 2: 68R0016; Supplier Part Number 1: 311-5.1KJRCT-ND; Created By: D. Gakure; Checked By: ?
R5 = RT0402FRE0768KL: RES SMD 68K OHM 1% 1/16W 0402; Manufacturer: Yageo; Temperature Coefficient: 50ppm/°C; Power Rating: 62.5mW; Voltage Rating: 50V; Max Power Dissipation: 63mW; Supplier 1: Digi-Key; RoHS: Yes; Category: Chip SMD Resistors; Stock 1: 19319; Pricing 1: 1=0.10000, 10=0.07000, 100=0.02830, 1000=0.01272, 2500=0.01104, 5000=0.00912 (USD); Case/Package: 0402; Contact Plating: Tin,Matte; Case Code (Metric): 1005; Min Operating Temperature: -55°C; Max Operating Temperature: 125°C; Resistor Type: Thin Film; Package Quantity: 10000; Packaging: Tape and Reel; Number of Terminations: 2; Termination: SMD/SMT; Voltage Rating (DC): 50V; Series: RT; Length: 0.039inch; Width: 0.02inch; Height: 0.014inch; Radiation Hardening: No; Lead Free: Lead Free; RoHS Compliant: Yes; ComponentLink1URL: https://datasheet.ciiva.com/2561/pyu-rt-1-to-0-05-rohs-l-5-2561824.pdf?src-supplier=Digi-Key; ComponentLink1Description: Online datasheet; Supplier 2: Mouser; Stock 2: 28756; Pricing 2: 1=0.24000, 10=0.05600, 50=0.05600, 100=0.01900, 1000=0.01400, 10000=0.00800 (USD); Created By: D. Gakure; Checked By: ?; Supplier Part Number 2: 603-RT0402FRE0768KL; Supplier Part Number 1: 13-RT0402FRE0768KLCT-ND; Manufacturer Part Number: RT0402FRE0768KL
R6 = RC0402FR-0752K3L: RES SMD 52.3K OHM 1% 1/16W 0402; Manufacturer: Yageo; Temperature Coefficient: 100ppm/°C; Power Rating: 62.5mW; Voltage Rating: 50V; Max Power Dissipation: 63mW; Supplier 1: Digi-Key; Manufacturer Part Number: RC0402FR-0752K3L; RoHS: Yes; Category: Chip SMD Resistors; Stock 1: 1178310; Pricing 1: 1=0.10000, 10=0.01600, 100=0.00640, 1000=0.00286, 2500=0.00248, 5000=0.00205 (USD); Case/Package: 0402; Contact Plating: Tin,Matte; Weight: 2.3E-05oz; Min Operating Temperature: -55°C; Max Operating Temperature: 155°C; Resistor Type: Thick Film; Packaging: Tape and Reel; Number of Terminations: 2; Termination: SMD/SMT; Voltage Rating (DC): 50V; Features: Moisture Resistant; Series: RC; Construction: Rectangular; Length: 1mm; Width: 0.02inch; Height: 0.016inch; Depth: 0.5mm; Military Standard: Not; Lead Free: Lead Free; RoHS Compliant: Yes; ComponentLink1URL: https://datasheet.ciiva.com/16867/pyu-rc0402-51-rohs-l-6-16867930.pdf; ComponentLink1Description: Oline datasheet; Supplier 2: Mouser; Stock 2: 83620; Pricing 2: 1=0.10000, 10=0.01200, 50=0.01200, 100=0.00400, 1000=0.00300, 10000=0.00300 (USD); Created By: D. Gakure; Checked By: ?; Supplier Part Number 2: 603-RC0402FR-0752K3L; Supplier Part Number 1: YAG3179CT-ND; Size Code: 0402; Case Code (Metric): 1005
R8 R9 = 0402WGF300JTCE: RES SMD 30 OHM 1% 1/16W 0402; Manufacturer: UNI-ROYAL(Uniroyal Elec); Manufacturer Part Number: 0402WGF300JTCE; Category: Chip SMD Resistors; Case Code (Imperial): 0402; Case Code (Metric): 1005; ComponentLink1URL: https://datasheet.lcsc.com/lcsc/1810301129_UNI-ROYAL-Uniroyal-Elec-0402WGF300JTCE_C270617.pdf; ComponentLink1Description: Online datasheet; Supplier 1: LCSC; Supplier 1 Part Number: C270617; Tolerance: 1%; Case/Package: 0402
R10 R13#1 R15 = RC0402FR-07150RL: RES SMD 150 OHM 1% 1/16W 0402; Manufacturer: Yageo; Power Rating: 62.5mW; Voltage Rating: 50V; Temperature Coefficient: 100ppm/°C; Max Power Dissipation: 63mW; Supplier 1: Digi-Key; Manufacturer Part Number: RC0402FR-07150RL; RoHS: Yes; Category: Chip SMD Resistors; Stock 1: 5214533; Pricing 1: 1=0.10000, 10=0.01400, 100=0.00580, 1000=0.00260, 2500=0.00226, 5000=0.00186 (USD); Case/Package: 0402; Case Code (Metric): 1005; Min Operating Temperature: -55°C; Max Operating Temperature: 155°C; Packaging: Tape and Reel; Package Quantity: 1; Resistor Type: Thick Film; Number of Terminations: 2; Termination: SMD/SMT; Working Voltage: 50V; Features: Moisture Resistant; Series: RC; Resistance Tolerance: 1%; Construction: Rectangular; Technology: THICK FILM; Length: 1mm; Width: 0.02inch; Height: 0.016inch; Depth: 0.5mm; REACH SVHC: No SVHC; Military Standard: Not; Lead Free: Lead Free; RoHS Compliant: Yes; ComponentLink1URL: https://datasheet.ciiva.com/11808/0900766b80c66297-11808422.pdf; ComponentLink1Description: ine datasheet; Supplier 2: Mouser; Stock 2: 582717; Pricing 2: 1=0.10000, 10=0.01200, 50=0.01200, 100=0.00400, 1000=0.00400, 10000=0.00300 (USD); Supplier 3: Farnell; Stock 3: 880000; Pricing 3: 10000=0.00270, 50000=0.00200 (GBP); Created by: D. Gakure; Checked By: ?; Supplier Part Number 3: 2421893; Supplier Part Number 2: 603-RC0402FR-07150RL; Supplier Part Number 1: 311-150LRCT-ND; Tolerance: 1%; Case Code (Imperial): 0402
R11 R17 = RC0402FR-0710KL: RES SMD 10K OHM 1% 1/16W 0402; Manufacturer: Yageo; Temperature Coefficient: 100ppm/°C; Voltage Rating (DC): 50V; Power Rating: 62.5mW; Supplier 1: Digi-Key; Manufacturer Part Number: RC0402FR-0710KL; RoHS: Yes; Category: Resistors; Stock 1: 40173593; Pricing 1: 1=0.10000, 10=0.01400, 100=0.00580, 1000=0.00262, 2500=0.00228, 5000=0.00188 (USD); Case/Package: 0402; Number of Pins: 2; Case Code (Metric): 1005; Min Operating Temperature: -55°C; Max Operating Temperature: 155°C; Resistor Type: Thick Film; Packaging: Tape and Reel; Voltage Rating: 50V; Termination: SMD/SMT; Working Voltage: 50V; Number of Terminations: 2; Length: 1mm; Height: 0.32mm; Width: 0.5mm; Depth: 0.5mm; Lead Pitch: 0.2mm; REACH SVHC: No SVHC; Lead Free: Lead Free; Military Standard: Not; ComponentLink1URL: https://datasheet.ciiva.com/7660/38568-7660787.pdf?src-supplier=Element14; ComponentLink1Description: https://datasheet.ciiva.com/7660/38568-7660787.pdf?src-supplier=Element14; ComponentLink2URL: https://datasheet.ciiva.com/7849/1784430-7849813.pdf?src-supplier=Element14; ComponentLink2Description: https://datasheet.ciiva.com/7849/1784430-7849813.pdf?src-supplier=Element14; ComponentLink3URL: https://datasheet.ciiva.com/7849/1686128-7849814.pdf?src-supplier=Element14; ComponentLink3Description: https://datasheet.ciiva.com/7849/1686128-7849814.pdf?src-supplier=Element14; ComponentLink4URL: https://datasheet.ciiva.com/7849/1784430-7849815.pdf?src-supplier=Element14; ComponentLink4Description: https://datasheet.ciiva.com/7849/1784430-7849815.pdf?src-supplier=Element14; ComponentLink5URL: https://datasheet.ciiva.com/22747/1018594-22747512.pdf?src-supplier=Element14; ComponentLink5Description: https://datasheet.ciiva.com/22747/1018594-22747512.pdf?src-supplier=Element14; ComponentLink6URL: https://datasheet.ciiva.com/12667/pyu-rc0402-51-rohs-l-6-r-12667067.pdf?src-supplier=Mouser; ComponentLink6Description: https://datasheet.ciiva.com/12667/pyu-rc0402-51-rohs-l-6-r-12667067.pdf?src-supplier=Mouser; ComponentLink7URL: https://datasheet.ciiva.com/7983/1018594-7983486.pdf?src-supplier=Element14; ComponentLink7Description: https://datasheet.ciiva.com/7983/1018594-7983486.pdf?src-supplier=Element14; Supplier 2: Mouser; Stock 2: 23672167; Pricing 2: 1=0.10000, 10=0.01300, 100=0.00400, 1000=0.00300, 2500=0.00300, 10000=0.00200 (USD); Supplier 3: Farnell; Stock 3: 370000; Pricing 3: 10000=0.00350 (GBP); Checked: ?; Created: DG; Supplier Part Number 1: 311-10.0KLRCT-ND; Supplier Part Number 2: 603-RC0402FR-0710KL; Supplier Part Number 3: 2363463; Tolerance: 1%; Case Code (Imperial): 0402
R12 R16 = RC0402JR-070RL: RES SMD 0 OHM JUMPER 1/16W 0402; Manufacturer: Yageo; Power Rating: 62.5mW; Tolerance: 5%; Voltage Rating: 50V; Temperature Coefficient: 200ppm/°C; Max Power Dissipation: 63mW; Supplier 1: Digi-Key; Manufacturer Part Number: RC0402JR-070RL; RoHS: Yes; Category: Resistors; Stock 1: 40652479; Pricing 1: 1=0.10000, 10=0.01200, 25=0.00840, 50=0.00640, 100=0.00480, 250=0.00364, 500=0.00292, 1000=0.00215, 5000=0.00154 (USD); Case/Package: 0402; Contact Plating: Tin,Matte; Case Code (Metric): 1005; Case Code (Imperial): 0402; Min Operating Temperature: -55°C; Max Operating Temperature: 155°C; Resistor Type: Thick Film; Packaging: Tape and Reel; Termination: SMD/SMT; Package Quantity: 1; Number of Terminations: 2; Features: Moisture Resistant; Length: 1mm; Width: 0.02inch; Height: 0.016inch; Depth: 0.5mm; Radiation Hardening: No; Lead Free: Lead Free; REACH SVHC: Unknown; Military Standard: Not; ComponentLink1URL: https://datasheet.ciiva.com/2452/pyu-rc0402-51-rohs-l-6-2452608.pdf; ComponentLink1Description: Online datasheet; Supplier 2: Mouser; Stock 2: 8807711; Pricing 2: 1=0.10000, 10=0.01000, 100=0.00400, 1000=0.00300, 2500=0.00200, 10000=0.00200 (USD); Supplier 3: Future Electronics; Stock 3: 29070000; Pricing 3: 10000=0.00120, 50000=0.00100, 200000=0.00100, 500000=0.00100, 1250000=0.00100 (USD); Supplier Part Number 3: 3375797; Supplier Part Number 2: 603-RC0402JR-070RL; Supplier Part Number 1: 311-0.0JRCT-ND; Created: DG; Checked: ?
R13#2 = RC0402FR-071KL: RES SMD 1K OHM 1% 1/16W 0402; Manufacturer: Yageo; Temperature Coefficient: 100ppm/°C; Voltage Rating (DC): 50V; Power Rating: 62.5mW; Supplier 1: Digi-Key; Manufacturer Part Number: RC0402FR-071KL; RoHS: Yes; Category: Resistors; Stock 1: 37591306; Pricing 1: 1=0.10000, 10=0.01400, 100=0.00580, 1000=0.00262, 2500=0.00228, 5000=0.00188 (USD); Case/Package: 0402; Number of Pins: 2; Case Code (Imperial): 0402; Case Code (Metric): 1005; Min Operating Temperature: -55°C; Max Operating Temperature: 155°C; Resistor Type: Thick Film; Tolerance: 1%; Packaging: Tape and Reel; Voltage Rating: 50V; Termination: SMD/SMT; Length: 1mm; Height: 0.32mm; Width: 0.5mm; Depth: 0.5mm; REACH SVHC: Unknown; Lead Free: Lead Free; Military Standard: Not; ComponentLink2URL: https://datasheet.ciiva.com/12666/pyu-rc0402-51-rohs-l-6-r-12666741.pdf; ComponentLink2Description: Online datasheet; Supplier 2: Mouser; Stock 2: 11912978; Pricing 2: 1=0.10000, 10=0.01200, 100=0.00400, 1000=0.00400, 2500=0.00400, 10000=0.00300 (USD); Supplier 3: Farnell; Stock 3: 29900; Pricing 3: 1=0.08130, 25=0.01210, 100=0.01120, 250=0.01030, 500=0.00900 (GBP); Supplier Part Number 3: 2132441; Supplier Part Number 2: 603-RC0402FR-071KL; Supplier Part Number 1: 311-1.00KLRDKR-ND; Created: D.G; Checked: ?
R14 = RC0402FR-07220RL: RES SMD 220 OHM 1% 1/16W 0402; Manufacturer: Yageo; Power Rating: 62.5mW; Voltage Rating: 50V; Temperature Coefficient: 100ppm/°C; Max Power Dissipation: 63mW; Supplier 1: Digi-Key; Manufacturer Part Number: RC0402FR-07220RL; RoHS: Yes; Category: Resistors; Stock 1: 1286042; Pricing 1: 1=0.10000, 10=0.01400, 100=0.00580, 1000=0.00262, 2500=0.00228, 5000=0.00188 (USD); Case/Package: 0402; Number of Pins: 2; Case Code (Metric): 1005; Min Operating Temperature: -55°C; Max Operating Temperature: 155°C; Tolerance: 1%; Packaging: Tape and Reel; Voltage Rating (DC): 50V; Package Quantity: 1; Termination: SMD/SMT; Resistor Type: Thick Film; Number of Terminations: 2; Features: Moisture Resistant; Length: 1mm; Height: 0.016inch; Width: 0.02inch; Depth: 0.5mm; REACH SVHC: No SVHC; Military Standard: Not; Lead Free: Lead Free; ComponentLink1URL: https://datasheet.ciiva.com/11819/0900766b80c66297-11819466.pdf; ComponentLink1Description: Online datasheet; Supplier 2: Mouser; Stock 2: 324625; Pricing 2: 1=0.10000, 10=0.01200, 100=0.00400, 1000=0.00400, 2500=0.00400, 10000=0.00300 (USD); Supplier 3: Farnell; Stock 3: 18234; Pricing 3: 1=0.08130, 25=0.01210, 100=0.01120, 250=0.01030, 500=0.00900 (GBP); Supplier Part Number 3: 2147864; Supplier Part Number 2: 603-RC0402FR-07220RL; Supplier Part Number 1: 311-220LRCT-ND; Created: D.G; Checked: ?
R18 R19 = RC0402FR-072K2L: RES SMD 2.2K OHM 1% 1/16W 0402; Manufacturer: Yageo; Power Rating: 63mW; Voltage Rating: 50V; Temperature Coefficient: 100ppm/°C; Supplier 1: Digi-Key; Manufacturer Part Number: RC0402FR-072K2L; RoHS: Yes; Category: Resistors; Stock 1: 6492087; Pricing 1: 1=0.10000, 10=0.01400, 100=0.00580, 1000=0.00262, 2500=0.00228, 5000=0.00188 (USD); Case/Package: 0402; Weight: 2.3E-05oz; Case Code (Metric): 1005; Min Operating Temperature: -55°C; Max Operating Temperature: 155°C; Resistor Type: Thick Film; Packaging: Tape and Reel; Termination: SMD/SMT; Length: 1mm; Height: 0.35mm; Width: 0.5mm; Depth: 0.5mm; REACH SVHC: Unknown; Military Standard: Not; Lead Free: Lead Free; ComponentLink1URL: https://datasheet.ciiva.com/11808/0900766b80c66297-11808786.pdf; ComponentLink1Description: Online datasheet; Supplier 2: Mouser; Stock 2: 1171407; Pricing 2: 1=0.10000, 10=0.01200, 100=0.00400, 1000=0.00400, 2500=0.00400, 10000=0.00300 (USD); Supplier 3: Farnell; Stock 3: 428944; Pricing 3: 10=0.01350, 100=0.01190, 500=0.01020, 2500=0.00460, 5000=0.00420, 10000=0.00370, 50000=0.00240 (GBP); Supplier Part Number 3: 9239278; Supplier Part Number 2: 603-RC0402FR-072K2L; Supplier Part Number 1: 311-2.20KLRCT-ND; Created By: D. Gakure; by: ?; Case Code (Imperial): 0402; Tolerance: 1%
SW1 SW2 = PTS810SJG250SMTRLFS: SWITCH TACTILE SPST-NO 0.05A 16V; Manufacturer: ITT /  C&K Components; Part # Aliases: Y97LT25B8DBFP; Operating Force: 3.9 N; Actuator: Oval; Current Rating: 50 mA; Voltage Rating DC: 16 VDC; Contact Form: SPST; Switch Function: OFF - (ON); Mounting Direction: Straight; Stem Height: 2.5 mm; Brand: C&K Components; Travel: 0.2 mm; Supplier 1: Digikey; Manufacturer Part Number: PTS810SJG250SMTRLFS; Stock 1: 76414; Pricing 1: 1=0.3, 10=0.29, 25=0.2792, 50=0.2688, 100=0.2585, 250=0.2378, 500=0.2068, 1000=0.1758 (USD); Product Category: Tactile Switches; RoHS: Details; Termination Style: J Form Lead; Mounting Style: SMD/SMT; Color: Blue; Packaging: Reel; Contact Plating: Silver; Operating Temperature Range: - 40 C to + 85 C; Series: PTS810; Factory Pack Quantity: 2900; ComponentLink1URL: https://datasheet.ciiva.com/18514/pts810-4mar13-18514167.pdf; ComponentLink1Description: Online datasheet; Supplier Part Number 1: CKN10504DKR-ND
TP1 TP2 TP5-TP14 = TestPoint: Test Point
U1 = AP2114HA-3.3TRG1: Fixed 6V 3.3V 390mV @ 1A SOT-223 Linear Voltage Regulators (LDO) RoHS; Manufacturer: BL(Shanghai Belling); Number of Regulators: 1; Manufacturer Part Number: BL9110-330BPFB; Category: Voltage Regulators - Linear; Mount: Surface Mount; Output Voltage: 3.3V; Output Current: 1A; ComponentLink1URL: https://datasheet.lcsc.com/lcsc/1811151657_BL-Shanghai-Belling-BL9110-330BPFB_C169246.pdf; ComponentLink1Description: Online datasheet; Supplier 1: LCSC; Suppliers 1 Part Number: C169246
U2 = TPS2553DBVR: IC PWR SWITCH N-CHAN 1:1 SOT23-6; Manufacturer: Texas Instruments; Number of Outputs: 1; Min Supply Voltage: 2.5V; Max Supply Voltage: 6.5V; On-State Resistance: 85mR; Output Current: 1.5A; Max Power Dissipation: 625mW; Supplier 1: Digi-Key; RoHS: Yes; Category: Hot Swap Controllers; Stock 1: 14713; Pricing 1: 1=1.20000, 10=1.07100, 25=1.01640, 100=0.78050, 250=0.68972, 500=0.65340, 1000=0.50820 (USD); Case/Package: SOT-23; Number of Pins: 6; Weight: 0.00127oz; Min Operating Temperature: -40°C; Max Operating Temperature: 85°C; Packaging: Tape and Reel; Package Quantity: 1; Max Input Voltage: 6.5V; Min Input Voltage: 2.5V; Radiation Hardening: No; Lead Free: Lead Free; REACH SVHC: No SVHC; ComponentLink1URL: https://datasheet.ciiva.com/15108/getdatasheetpartid-297517-15108509.pdf; ComponentLink1Description: Online datasheet; Supplier 2: Farnell; Supplier 3: Mouser; Supplier Part Number 3: 595-TPS2553DBVR; Supplier Part Number 2: 3124082; Supplier Part Number 1: 296-32464-1-ND; Manufacturer Part Number: TPS2553DBVR
U3 = ESP32-S2-WROOM: Wi-Fi Module 802.11b/g/n ESP32-D0WD-V3 w/ Antenna, ADC, I2C, I2S, SPI, PWM, UART; Manufacturer: Espressif Systems; Supplier 1: Digi-Key; RoHS: No; Category: RF Receivers, Transceivers; Stock 1: 965; Pricing 1: 1=2.13000 (USD); Supplier Part Number 1: 1965-ESP32-S2-WROOMCT-ND; Created By: D Gakure; Checked By: ?; ComponentLink1Description: Online datasheet; ComponentLink1URL: https://www.espressif.com/sites/default/files/documentation/esp32-s2-wroom_esp32-s2-wroom-i_datasheet_en.pdf; Manufacturer Part Number: ESP32-S2-WROOM
X1 = ECS-.327-12.5-34S-TR: CRYSTAL 32.7680KHZ 12.5PF SMD; Manufacturer: ECS International; Frequency Tolerance: 20ppm; ESR (Equivalent Series Resistance): 70kR; Supplier 1: Mouser; RoHS: Yes; Category: Crystals; Stock 1: 10; Pricing 1: 1=1.24000, 10=1.11000, 50=1.04000, 100=0.91300, 1000=0.72000, 10000=0.69500 (USD); Mount: Surface Mount; Case/Package: SMD/SMT; Number of Pins: 2; Min Operating Temperature: -40°C; Max Operating Temperature: 125°C; Package Quantity: 3000; Packaging: Tape and Reel; Termination: SMD/SMT; Series: ECX-34S; Tolerance: 20ppm; Length: 0.126inch; Width: 1.5mm; Height: 0.035inch; Lead Pitch: 1.8mm; RoHS Compliant: Yes; Lead Free: Lead Free; ComponentLink1URL: https://datasheet.ciiva.com/15047/ecx-34s-15047020.pdf; ComponentLink1Description: Online datasheet; Supplier Part Number 1: 520-ECS32.7-12.534ST; Created By: D Gakure; Checked By: ?; Manufacturer Part Number: ECS-.327-12.5-34S-TR